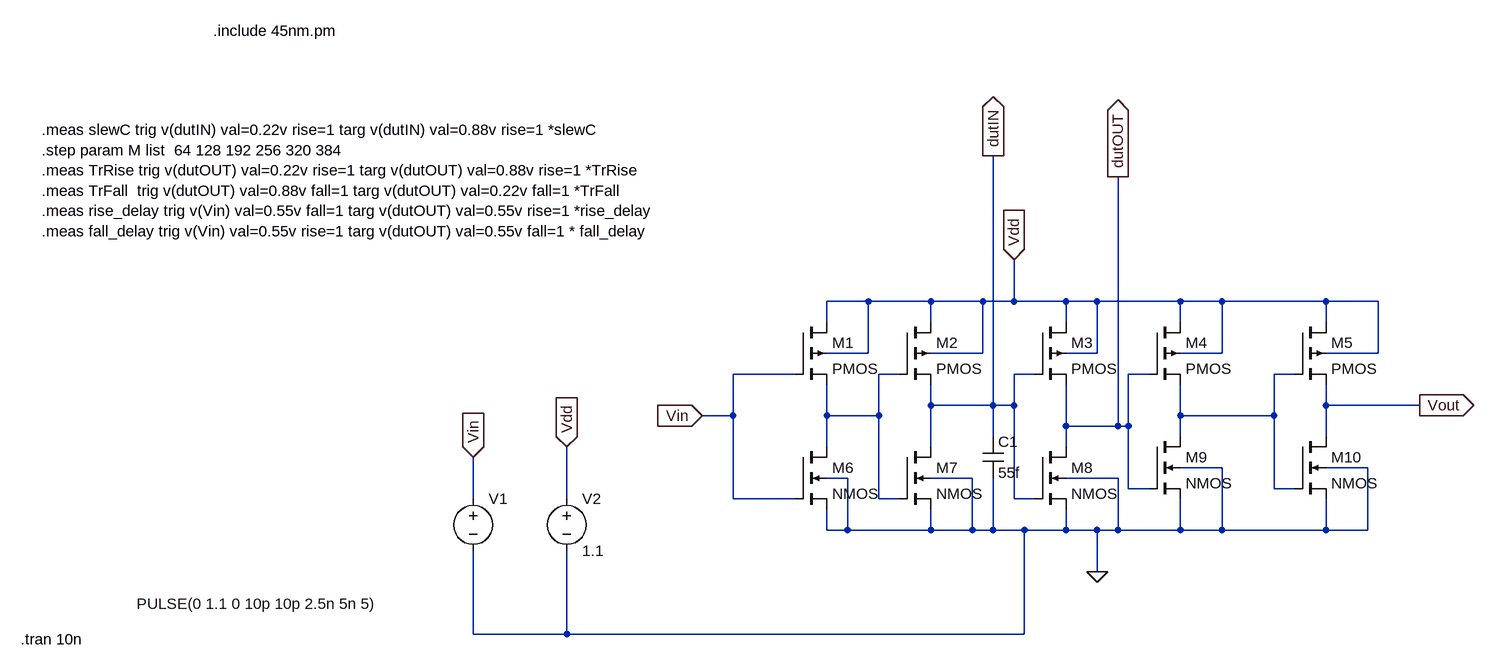
[diagram p0: schematic hw-b.asc]
hw-b.asc, the LTspice schematic file:
Version 4
SHEET 1 1936 760
WIRE 976 224 912 224
WIRE 1072 224 976 224
WIRE 1152 224 1072 224
WIRE 1200 224 1200 160
WIRE 1200 224 1152 224
WIRE 1280 224 1200 224
WIRE 1328 224 1280 224
WIRE 1456 224 1328 224
WIRE 1520 224 1456 224
WIRE 1680 224 1520 224
WIRE 1760 224 1680 224
WIRE 912 256 912 224
WIRE 1072 256 1072 224
WIRE 1280 256 1280 224
WIRE 1456 256 1456 224
WIRE 1680 256 1680 224
WIRE 976 304 976 224
WIRE 976 304 912 304
WIRE 1152 304 1152 224
WIRE 1152 304 1072 304
WIRE 1328 304 1328 224
WIRE 1328 304 1280 304
WIRE 1520 304 1520 224
WIRE 1520 304 1456 304
WIRE 1760 304 1760 224
WIRE 1760 304 1680 304
WIRE 864 336 768 336
WIRE 1024 336 992 336
WIRE 1232 336 1200 336
WIRE 1408 336 1376 336
WIRE 1632 336 1600 336
WIRE 1072 384 1072 352
WIRE 1168 384 1168 0
WIRE 1168 384 1072 384
WIRE 1200 384 1200 336
WIRE 1200 384 1168 384
WIRE 1680 384 1680 352
WIRE 1824 384 1680 384
WIRE 768 400 768 336
WIRE 768 400 720 400
WIRE 912 400 912 352
WIRE 992 400 992 336
WIRE 992 400 912 400
WIRE 1456 400 1456 352
WIRE 1600 400 1600 336
WIRE 1600 400 1456 400
WIRE 1280 416 1280 352
WIRE 1360 416 1360 32
WIRE 1360 416 1280 416
WIRE 1376 416 1376 336
WIRE 1376 416 1360 416
WIRE 1168 432 1168 384
WIRE 1456 432 1456 400
WIRE 1680 432 1680 384
WIRE 912 448 912 400
WIRE 1072 448 1072 384
WIRE 1280 448 1280 416
WIRE 1520 480 1456 480
WIRE 1744 480 1680 480
WIRE 944 496 912 496
WIRE 1136 496 1072 496
WIRE 1360 496 1280 496
WIRE 1376 512 1376 416
WIRE 1408 512 1376 512
WIRE 1600 512 1600 400
WIRE 1632 512 1600 512
WIRE 368 528 368 464
WIRE 512 528 512 448
WIRE 768 528 768 400
WIRE 864 528 768 528
WIRE 992 528 992 400
WIRE 1024 528 992 528
WIRE 1200 528 1200 384
WIRE 1232 528 1200 528
WIRE 912 576 912 544
WIRE 944 576 944 496
WIRE 944 576 912 576
WIRE 1072 576 1072 544
WIRE 1072 576 944 576
WIRE 1136 576 1136 496
WIRE 1136 576 1072 576
WIRE 1168 576 1168 496
WIRE 1168 576 1136 576
WIRE 1216 576 1168 576
WIRE 1280 576 1280 544
WIRE 1280 576 1216 576
WIRE 1328 576 1280 576
WIRE 1360 576 1360 496
WIRE 1360 576 1328 576
WIRE 1456 576 1456 528
WIRE 1456 576 1360 576
WIRE 1520 576 1520 480
WIRE 1520 576 1456 576
WIRE 1680 576 1680 528
WIRE 1680 576 1520 576
WIRE 1744 576 1744 480
WIRE 1744 576 1680 576
WIRE 1328 640 1328 576
WIRE 368 736 368 608
WIRE 512 736 512 608
WIRE 512 736 368 736
WIRE 1216 736 1216 576
WIRE 1216 736 512 736
FLAG 1200 160 Vdd
IOPIN 1200 160 In
FLAG 720 400 Vin
IOPIN 720 400 In
FLAG 1328 640 0
FLAG 1824 384 Vout
IOPIN 1824 384 Out
FLAG 368 464 Vin
IOPIN 368 464 In
FLAG 512 448 Vdd
IOPIN 512 448 In
FLAG 1168 0 dutIN
IOPIN 1168 0 Out
FLAG 1360 32 dutOUT
IOPIN 1360 32 Out
SYMBOL pmos4 864 256 R0
SYMATTR InstName M1
SYMATTR Value2 l=45n w=0.296u
SYMBOL pmos4 1024 256 R0
SYMATTR InstName M2
SYMATTR Value2 l=45n w=0.296u m=4
SYMBOL pmos4 1232 256 R0
SYMATTR InstName M3
SYMATTR Value2 l=45n w=0.296u m=16
SYMBOL pmos4 1408 256 R0
SYMATTR InstName M4
SYMATTR Value2 l=45n w=0.296u m={M}
SYMBOL pmos4 1632 256 R0
SYMATTR InstName M5
SYMATTR Value2 l=45n w=0.296u m=256
SYMBOL nmos4 864 448 R0
SYMATTR InstName M6
SYMATTR Value2 l=45n w=0.2u
SYMBOL nmos4 1024 448 R0
SYMATTR InstName M7
SYMATTR Value2 l=45n w=0.2u m=4
SYMBOL nmos4 1232 448 R0
SYMATTR InstName M8
SYMATTR Value2 l=45n w=0.2u m=16
SYMBOL nmos4 1408 432 R0
SYMATTR InstName M9
SYMATTR Value2 l=45n w=0.2u m={M}
SYMBOL nmos4 1632 432 R0
SYMATTR InstName M10
SYMATTR Value2 l=45n w=0.2u m=256
SYMBOL voltage 368 512 R0
WINDOW 123 0 0 Left 0
WINDOW 39 0 0 Left 0
WINDOW 3 -518 177 Left 2
SYMATTR Value PULSE(0 1.1 0 10p 10p 2.5n 5n 5)
SYMATTR InstName V1
SYMBOL voltage 512 512 R0
WINDOW 123 0 0 Left 0
WINDOW 39 0 0 Left 0
SYMATTR InstName V2
SYMATTR Value 1.1
SYMBOL cap 1152 432 R0
SYMATTR InstName C1
SYMATTR Value 55f
TEXT -32 -192 Left 2 !.include 45nm.pm
TEXT -296 -40 Left 2 !.meas slewC trig v(dutIN) val=0.22v rise=1 targ v(dutIN) val=0.88v rise=1 *slewC\n.step param M list  64 128 192 256 320 384\n.meas TrRise trig v(dutOUT) val=0.22v rise=1 targ v(dutOUT) val=0.88v rise=1 *TrRise\n.meas TrFall  trig v(dutOUT) val=0.88v fall=1 targ v(dutOUT) val=0.22v fall=1 *TrFall\n.meas rise_delay trig v(Vin) val=0.55v fall=1 targ v(dutOUT) val=0.55v rise=1 *rise_delay\n.meas fall_delay trig v(Vin) val=0.55v rise=1 targ v(dutOUT) val=0.55v fall=1 * fall_delay
TEXT -328 744 Left 2 !.tran 10n

The netlist it stands for:
* hw-b.asc
M1 Vdd Vin N001 Vdd PMOS l=45n w=0.296u
M2 Vdd N001 dutIN Vdd PMOS l=45n w=0.296u m=4
M3 Vdd dutIN dutOUT Vdd PMOS l=45n w=0.296u m=16
M4 Vdd dutOUT N002 Vdd PMOS l=45n w=0.296u m={M}
M5 Vdd N002 Vout Vdd PMOS l=45n w=0.296u m=256
M6 N001 Vin 0 0 NMOS l=45n w=0.2u
M7 dutIN N001 0 0 NMOS l=45n w=0.2u m=4
M8 dutOUT dutIN 0 0 NMOS l=45n w=0.2u m=16
M9 N002 dutOUT 0 0 NMOS l=45n w=0.2u m={M}
M10 Vout N002 0 0 NMOS l=45n w=0.2u m=256
V1 Vin 0 PULSE(0 1.1 0 10p 10p 2.5n 5n 5)
V2 Vdd 0 1.1
C1 dutIN 0 55f
.model NMOS NMOS
.model PMOS PMOS
.lib standard.mos
.include 45nm.pm
.meas slewC trig v(dutIN) val=0.22v rise=1 targ v(dutIN) val=0.88v rise=1 *slewC
.step param M list  64 128 192 256 320 384
.meas TrRise trig v(dutOUT) val=0.22v rise=1 targ v(dutOUT) val=0.88v rise=1 *TrRise
.meas TrFall  trig v(dutOUT) val=0.88v fall=1 targ v(dutOUT) val=0.22v fall=1 *TrFall
.meas rise_delay trig v(Vin) val=0.55v fall=1 targ v(dutOUT) val=0.55v rise=1 *rise_delay
.meas fall_delay trig v(Vin) val=0.55v rise=1 targ v(dutOUT) val=0.55v fall=1 * fall_delay
.tran 10n
.backanno
.end